# Altium project GCM-Test PCB BW_PRJ.PrjPcb
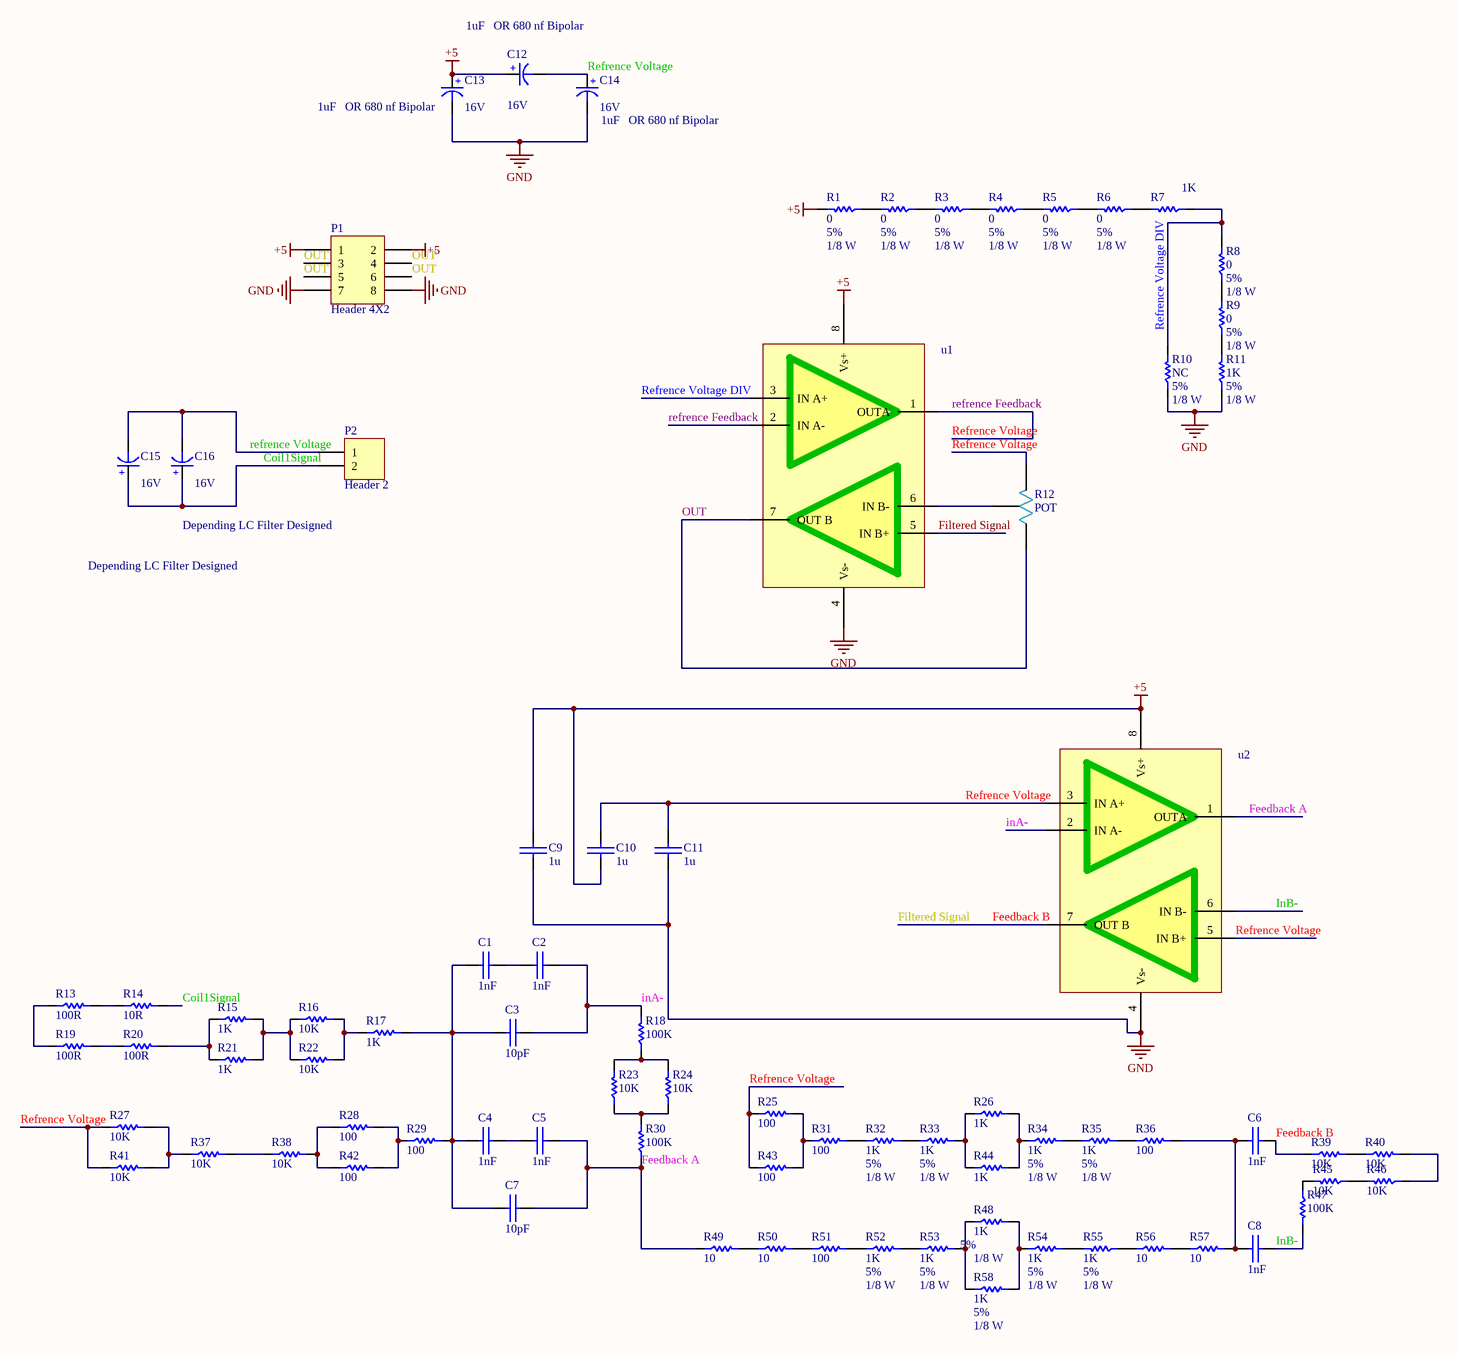
[diagram p0: GCM-Test PCB BW_SCH.SchDoc]
1 sheet, 78 parts. Net scope: global (net labels, ports and power ports of the same name join across sheets).
Board file: GCM-Test PCB BW_PCB.PcbDoc

## Sheet GCM-Test PCB BW_SCH.SchDoc
size C

### Parts
C1  1nF  [SMD_CAP_1206]
C2  1nF  [SMD_CAP_1206]
C3  10pF  [SMD_CAP_1206]
C4  1nF  [SMD_CAP_1206]
C5  1nF  [SMD_CAP_1206]
C6  1nF  [SMD_CAP_1206]
C7  10pF  [SMD_CAP_1206]
C8  1nF  [SMD_CAP_1206]
C9  1u  [SMD_CAP_1206]
C10  1u  [SMD_CAP_1206]
C11  1u  [SMD_CAP_1206]
C12  Voltage: 16V  [cap 01]  (hidden comment: 1uF   OR 680 nf Bipolar)
C13  Voltage: 16V  [cap 01]  (hidden comment: 1uF   OR 680 nf Bipolar)
C14  Voltage: 16V  [cap 01]  (hidden comment: 1uF   OR 680 nf Bipolar)
C15  Voltage: 16V  [cap 01]  (hidden comment: Depending LC Filter Designed)
C16  Voltage: 16V  [cap 01]  (hidden comment: Depending LC Filter Designed)
P1  Header 4X2  [HDR2X4]
P2  Header 2  [HDR1X2]
R1  Tolerance: 5%  Power: 1/8 W  [RES 1206 (3216X08L)]  (hidden comment: 0)
R2  Tolerance: 5%  Power: 1/8 W  [RES 1206 (3216X08L)]  (hidden comment: 0)
R3  Tolerance: 5%  Power: 1/8 W  [RES 1206 (3216X08L)]  (hidden comment: 0)
R4  Tolerance: 5%  Power: 1/8 W  [RES 1206 (3216X08L)]  (hidden comment: 0)
R5  Tolerance: 5%  Power: 1/8 W  [RES 1206 (3216X08L)]  (hidden comment: 0)
R6  Tolerance: 5%  Power: 1/8 W  [RES 1206 (3216X08L)]  (hidden comment: 0)
R7  1K  [RES 1206 (3216X08L)]
R8  Tolerance: 5%  Power: 1/8 W  [RES 1206 (3216X08L)]  (hidden comment: 0)
R9  Tolerance: 5%  Power: 1/8 W  [RES 1206 (3216X08L)]  (hidden comment: 0)
R10  Tolerance: 5%  Power: 1/8 W  [RES 1206 (3216X08L)]  (hidden comment: NC)
R11  Tolerance: 5%  Power: 1/8 W  [RES 1206 (3216X08L)]  (hidden comment: 1K)
R12  POT  [MOL_1]
R13  100R  [RES 1206 (3216X08L)]
R14  10R  [RES 1206 (3216X08L)]
R15  1K  [RES 1206 (3216X08L)]
R16  10K  [RES 1206 (3216X08L)]
R17  1K  [RES 1206 (3216X08L)]
R18  100K  [RES 1206 (3216X08L)]
R19  100R  [RES 1206 (3216X08L)]
R20  100R  [RES 1206 (3216X08L)]
R21  1K  [RES 1206 (3216X08L)]
R22  10K  [RES 1206 (3216X08L)]
R23  10K  [RES 1206 (3216X08L)]
R24  10K  [RES 1206 (3216X08L)]
R25  100  [RES 1206 (3216X08L)]
R26  1K  [RES 1206 (3216X08L)]
R27  10K  [RES 1206 (3216X08L)]
R28  100  [RES 1206 (3216X08L)]
R29  100  [RES 1206 (3216X08L)]
R30  100K  [RES 1206 (3216X08L)]
R31  100  [RES 1206 (3216X08L)]
R32  Tolerance: 5%  Power: 1/8 W  [RES 1206 (3216X08L)]  (hidden comment: 1K)
R33  Tolerance: 5%  Power: 1/8 W  [RES 1206 (3216X08L)]  (hidden comment: 1K)
R34  Tolerance: 5%  Power: 1/8 W  [RES 1206 (3216X08L)]  (hidden comment: 1K)
R35  Tolerance: 5%  Power: 1/8 W  [RES 1206 (3216X08L)]  (hidden comment: 1K)
R36  100  [RES 1206 (3216X08L)]
R37  10K  [RES 1206 (3216X08L)]
R38  10K  [RES 1206 (3216X08L)]
R39  10K  [RES 1206 (3216X08L)]
R40  10K  [RES 1206 (3216X08L)]
R41  10K  [RES 1206 (3216X08L)]
R42  100  [RES 1206 (3216X08L)]
R43  100  [RES 1206 (3216X08L)]
R44  1K  [RES 1206 (3216X08L)]
R45  10K  [RES 1206 (3216X08L)]
R46  10K  [RES 1206 (3216X08L)]
R47  100K  [RES 1206 (3216X08L)]
R48  Tolerance: 5%  Power: 1/8 W  [RES 0805 (2012X06L)]  (hidden comment: 1K)
R49  10  [RES 0805 (2012X06L)]
R50  10  [RES 0805 (2012X06L)]
R51  100  [RES 0805 (2012X06L)]
R52  Tolerance: 5%  Power: 1/8 W  [RES 1206 (3216X08L)]  (hidden comment: 1K)
R53  Tolerance: 5%  Power: 1/8 W  [RES 1206 (3216X08L)]  (hidden comment: 1K)
R54  Tolerance: 5%  Power: 1/8 W  [RES 1206 (3216X08L)]  (hidden comment: 1K)
R55  Tolerance: 5%  Power: 1/8 W  [RES 1206 (3216X08L)]  (hidden comment: 1K)
R56  10  [RES 0805 (2012X06L)]
R57  10  [RES 0805 (2012X06L)]
R58  Tolerance: 5%  Power: 1/8 W  [RES 0805 (2012X06L)]  (hidden comment: 1K)
u1  LM358N  [lm358 dip]  (value not drawn)
u2  LM358N  [lm358 dip]  (value not drawn)

### Nets
+5: C9.1(+) C10.2(-) C12.1(+) C13.1(+) P1.1 P1.2 R1.2 u1.8(Vs+) u2.8(Vs+)
GND: C9.2(-) C11.2(-) C13.2(-) C14.2(-) P1.7 P1.8 R10.1 R11.1 u1.4(Vs-) u2.4(Vs-)
Coil1Signal: C15.1(+) C16.1(+) P2.2 R14.2
Feedback A: C5.2(-) C7.2(-) R30.1 R49.1 u2.1(OUTA)
Feedback B: C6.2(-) R39.1 u1.5(IN_B+) u2.7(OUT_B)  [also labelled Filtered Signal]
inA-: C2.2(-) C3.2(-) R18.2 u2.2(IN_A-)
InB-: C8.2(-) R47.2 u2.6(IN_B-)
OUT: P1.3 P1.4 P1.5 P1.6 R12.1 u1.7(OUT_B)
refrence Feedback: C10.1(+) C11.1(+) C12.2(-) C14.1(+) C15.2(-) C16.2(-) P2.1 R12.3 R25.1 R27.1 R41.1 R43.1 u1.1(OUTA) u1.2(IN_A-) u2.3(IN_A+) u2.5(IN_B+)  [also labelled Refrence Voltage]
Refrence Voltage DIV: R7.1 R8.2 R10.2 u1.3(IN_A+)
NetC1_1: C1.1(+) C3.1(+) C4.1(+) C7.1(+) R17.2 R29.2
NetC1_2: C1.2(-) C2.1(+)
NetC4_2: C4.2(-) C5.1(+)
NetC6_1: C6.1(+) C8.1(+) R36.2 R57.2
NetR1_1: R1.1 R2.2
NetR2_1: R2.1 R3.2
NetR3_1: R3.1 R4.2
NetR4_1: R4.1 R5.2
NetR5_1: R5.1 R6.2
NetR6_1: R6.1 R7.2
NetR8_1: R8.1 R9.2
NetR9_1: R9.1 R11.2
NetR12_2: R12.2 u1.6(IN_B-)
NetR13_1: R13.1 R19.1
NetR13_2: R13.2 R14.1
NetR15_1: R15.1 R20.2 R21.1
NetR15_2: R15.2 R16.1 R21.2 R22.1
NetR16_2: R16.2 R17.1 R22.2
NetR18_1: R18.1 R23.2 R24.2
NetR19_2: R19.2 R20.1
NetR23_1: R23.1 R24.1 R30.2
NetR25_2: R25.2 R31.1 R43.2
NetR26_1: R26.1 R33.2 R44.1
NetR26_2: R26.2 R34.1 R44.2
NetR27_2: R27.2 R37.1 R41.2
NetR28_1: R28.1 R38.2 R42.1
NetR28_2: R28.2 R29.1 R42.2
NetR31_2: R31.2 R32.1
NetR32_2: R32.2 R33.1
NetR34_2: R34.2 R35.1
NetR35_2: R35.2 R36.1
NetR37_2: R37.2 R38.1
NetR39_2: R39.2 R40.1
NetR40_2: R40.2 R46.1
NetR45_1: R45.1 R46.2
NetR45_2: R45.2 R47.1
NetR48_1: R48.1 R53.2 R58.1
NetR48_2: R48.2 R54.1 R58.2
NetR49_2: R49.2 R50.1
NetR50_2: R50.2 R51.1
NetR51_2: R51.2 R52.1
NetR52_2: R52.2 R53.1
NetR54_2: R54.2 R55.2
NetR55_1: R55.1 R56.1
NetR56_2: R56.2 R57.1

### Library data of the parts
C1-C11 = Cap-Bipolar: Bipolar Capacitor; Voltage: 100V; Designer: Saeid Jorablo; Organazation: ControTec; Adding Date: 1387/12/20
  C1 C2 C4-C6 C8: Value: 1nF
  C3 C7: Value: 10pF
  C9-C11: Value: 1u
C12-C16 = Cap-Polar: Polar Capacitor; Designer: Saeid Jorablo; Organazation: ControTec; Adding Date: 1387/12/20
  C12-C14: Value: 1uF   OR 680 nf Bipolar
  C15 C16: Value: Depending LC Filter Designed
P1 = Header 4X2: Header, 4-Pin, Dual row; LatestRevisionDate: 17-Jul-2002; LatestRevisionNote: Re-released for DXP Platform.; Publisher: Altium Limited
P2 = Header 2: Header, 2-Pin; LatestRevisionDate: 17-Jul-2002; LatestRevisionNote: Re-released for DXP Platform.; Publisher: Altium Limited
R1-R6 R8-R11 R32-R35 R48 R52-R55 R58 = Resistor
  R1-R6 R8 R9: Value: 0
  R10: Value: NC
  R11 R32-R35 R48 R52-R55 R58: Value: 1K
R7 R13-R31 R36-R47 R49-R51 R56 R57 = Resistor: Tolerance: 5%; Power: 1/8 W
  R7 R15 R17 R21 R26 R44: Value: 1K
  R13 R19 R20: Value: 100R
  R14: Value: 10R
  R16 R22-R24 R27 R37-R41 R45 R46: Value: 10K
  R18 R30 R47: Value: 100K
  R25 R28 R29 R31 R36 R42 R43 R51: Value: 100
  R49 R50 R56 R57: Value: 10
u1 u2 = LM358N: DESIGNER: Ehsan Shaghaei